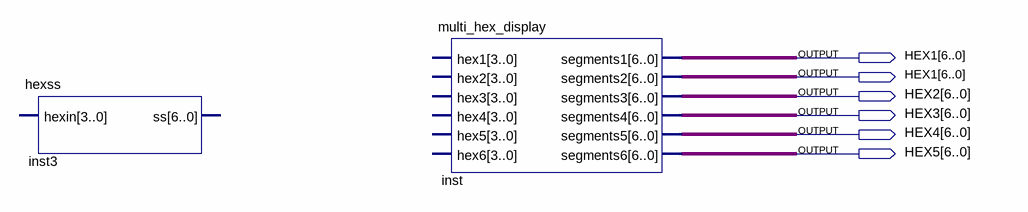
[diagram p0: schematic sheet]
// Quartus schematic multi_hex.bdf as structural Verilog: 2 symbols, 6 pins
module multi_hex (
  output [6:0] HEX1,
  output [6:0] HEX2,
  output [6:0] HEX3,
  output [6:0] HEX4,
  output [6:0] HEX5
);

  hexss inst3 ();  // open: hexin, ss
  multi_hex_display inst (
    .segments1(HEX1), .segments2(HEX1), .segments3(HEX2), .segments4(HEX3), .segments5(HEX4), .segments6(HEX5));  // open: hex1, hex2, hex3, hex4, hex5, hex6
endmodule
